# EAGLE design ArduinoDigitalCommsShield (EAGLE 6.5.0)
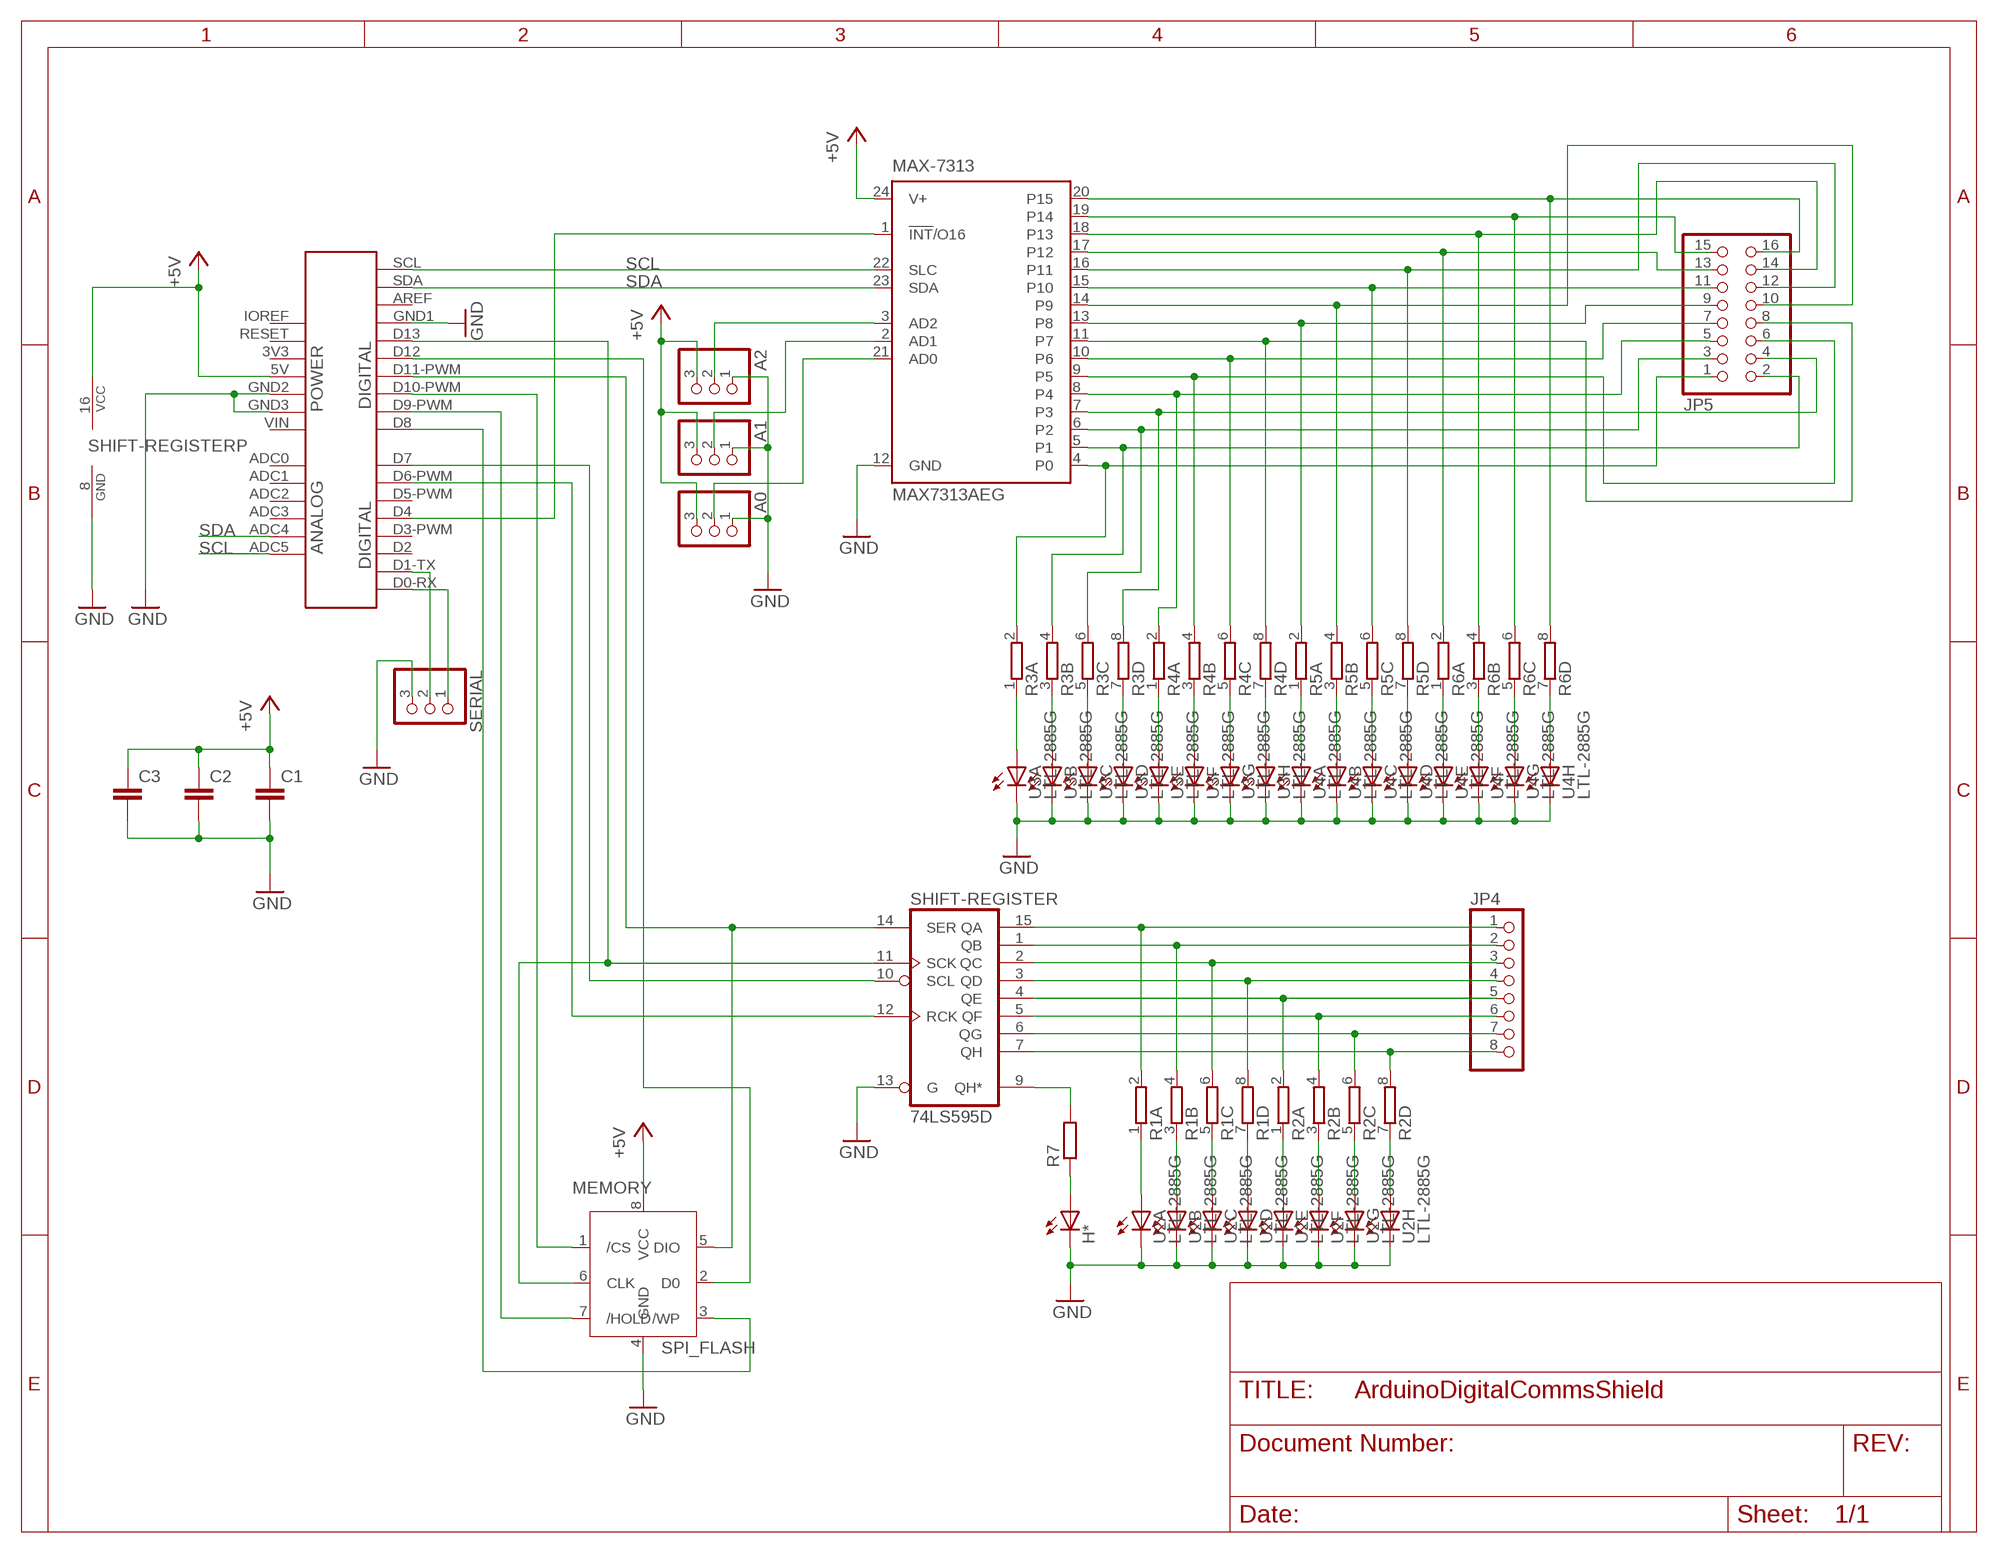
[diagram p0: schematic, sheet 1]

## Parts
A0  PINHD-1X3_2.54  [1X03]
A1  PINHD-1X3_2.54  [1X03]
A2  PINHD-1X3_2.54  [1X03]
ARD1  UNO-R3  [UNO-R3]
C1  C-EUC0603  [C0603]
C2  C-EUC0603  [C0603]
C3  C-EUC0603  [C0603]
H*  LED5MM  [LED5MM]
JP4  PINHD-1X8_2.54  [1X08]
JP5  PINHD-2X8_2.54  [2X08]
MAX-7313  MAX7313AEG  [QSOP24]
MEMORY  SPI_FLASH  [SOIC-8]
R1  4R-NCTS742C083  [CTS742C083-RES]
R2  4R-NCTS742C083  [CTS742C083-RES]
R3  4R-NCTS742C083  [CTS742C083-RES]
R4  4R-NCTS742C083  [CTS742C083-RES]
R5  4R-NCTS742C083  [CTS742C083-RES]
R6  4R-NCTS742C083  [CTS742C083-RES]
R7  R-EU_R0603  [R0603]
SERIAL  PINHD-1X3_2.54  [1X03]
SHIFT-REGISTER  74LS595D  [SO16]
U2  LTL-2885G  [LTL-2*85]
U3  LTL-2885G  [LTL-2*85]
U4  LTL-2885G  [LTL-2*85]

## Nets
+5V: A0.3 A1.3 A2.3 ARD1.5V C1.1 C2.1 C3.1 MAX-7313.24(V+) MEMORY.8(VCC) SHIFT-REGISTER.16(VCC)
GND: A0.1 A1.1 A2.1 ARD1.GND1 ARD1.GND2 ARD1.GND3 C1.2 C2.2 C3.2 H*.K(C) MAX-7313.12(GND) MEMORY.4(GND) SERIAL.3 SHIFT-REGISTER.8(GND) SHIFT-REGISTER.13(G) U2.1(A:C) U2.4(B:C) U2.5(C:C) U2.8(D:C) U2.9(E:C) U2.12(F:C) U2.13(G:C) U2.16(H:C) U3.1(A:C) U3.4(B:C) U3.5(C:C) U3.8(D:C) U3.9(E:C) U3.12(F:C) U3.13(G:C) U3.16(H:C) U4.1(A:C) U4.4(B:C) U4.5(C:C) U4.8(D:C) U4.9(E:C) U4.12(F:C) U4.13(G:C) U4.16(H:C)
N$1: A2.2 MAX-7313.3(AD2)
N$2: A1.2 MAX-7313.2(AD1)
N$3: A0.2 MAX-7313.21(AD0)
N$4: ARD1.D11-PWM(D11) MEMORY.5(DIO) SHIFT-REGISTER.14(SER)
N$5: ARD1.D13 MEMORY.6(CLK) SHIFT-REGISTER.11(SCK)
N$6: ARD1.D7 SHIFT-REGISTER.10(SCL)
N$7: ARD1.D6-PWM(D6) SHIFT-REGISTER.12(RCK)
N$8: ARD1.D4 MAX-7313.1(!INT!/O16)
N$9: JP4.1 R1.2 SHIFT-REGISTER.15(QA)
N$10: JP4.2 R1.4 SHIFT-REGISTER.1(QB)
N$11: JP4.3 R1.6 SHIFT-REGISTER.2(QC)
N$12: JP4.4 R1.8 SHIFT-REGISTER.3(QD)
N$13: JP4.5 R2.2 SHIFT-REGISTER.4(QE)
N$14: JP4.6 R2.4 SHIFT-REGISTER.5(QF)
N$15: JP4.7 R2.6 SHIFT-REGISTER.6(QG)
N$16: JP4.8 R2.8 SHIFT-REGISTER.7(QH)
N$17: JP5.1 MAX-7313.4(P0) R3.2
N$18: JP5.2 MAX-7313.5(P1) R3.4
N$19: JP5.3 MAX-7313.6(P2) R3.6
N$20: JP5.4 MAX-7313.7(P3) R3.8
N$21: JP5.5 MAX-7313.8(P4) R4.2
N$22: JP5.6 MAX-7313.9(P5) R4.4
N$23: JP5.7 MAX-7313.10(P6) R4.6
N$24: JP5.8 MAX-7313.11(P7) R4.8
N$25: JP5.16 MAX-7313.20(P15) R6.8
N$26: JP5.15 MAX-7313.19(P14) R6.6
N$27: JP5.14 MAX-7313.18(P13) R6.4
N$28: JP5.13 MAX-7313.17(P12) R6.2
N$29: JP5.12 MAX-7313.16(P11) R5.8
N$30: JP5.11 MAX-7313.15(P10) R5.6
N$31: JP5.10 MAX-7313.14(P9) R5.4
N$32: JP5.9 MAX-7313.13(P8) R5.2
N$33: ARD1.D10-PWM(D10) MEMORY.1(/CS)
N$34: ARD1.D12 MEMORY.2(D0)
N$35: ARD1.D9-PWM(D9) MEMORY.7(/HOLD)
N$36: ARD1.D8 MEMORY.3(/WP)
N$37: ARD1.D1-TX(D1) SERIAL.2
N$38: ARD1.D0-RX(D0) SERIAL.1
N$39: H*.A R7.1
N$40: R7.2 SHIFT-REGISTER.9(QH*)
N$54: R1.1 U2.2(A:A)
N$55: R1.3 U2.3(B:A)
N$56: R1.5 U2.6(C:A)
N$57: R1.7 U2.7(D:A)
N$58: R2.1 U2.10(E:A)
N$59: R2.3 U2.11(F:A)
N$60: R2.5 U2.14(G:A)
N$61: R2.7 U2.15(H:A)
N$62: R3.1 U3.2(A:A)
N$63: R3.3 U3.3(B:A)
N$64: R3.5 U3.6(C:A)
N$65: R3.7 U3.7(D:A)
N$66: R4.1 U3.10(E:A)
N$67: R4.3 U3.11(F:A)
N$68: R4.5 U3.14(G:A)
N$69: R4.7 U3.15(H:A)
N$70: R5.1 U4.2(A:A)
N$71: R5.3 U4.3(B:A)
N$72: R5.5 U4.6(C:A)
N$73: R5.7 U4.7(D:A)
N$74: R6.1 U4.10(E:A)
N$75: R6.3 U4.11(F:A)
N$76: R6.5 U4.14(G:A)
N$77: R6.7 U4.15(H:A)
SCL: ARD1.ADC5 ARD1.SCL MAX-7313.22(SLC)
SDA: ARD1.ADC4 ARD1.SDA MAX-7313.23(SDA)
Unconnected: ARD1.3V3 ARD1.ADC0 ARD1.ADC1 ARD1.ADC2 ARD1.ADC3 ARD1.AREF ARD1.D2 ARD1.D3-PWM(D3) ARD1.D5-PWM(D5) ARD1.IOREF ARD1.RESET ARD1.VIN

## Library data of the parts
A0 A1 A2 SERIAL = pinhead-1:PINHD-1X3: PIN HEADER
ARD1 = arduino-shields:UNO-R3
C1-C3 = resistor:C-EU: CAPACITOR, European symbol
H* = led:LED: LED OSRAM: - CHIPLED LG R971, LG N971, LY N971, LG Q971, LY Q971, LO R971, LY R971 LH N974, LH R974 LS Q976, LO Q976, LY Q976 LO Q996 - Hyper CHIPLED LW Q18S LB Q993, LB Q99A, LB R99A - SideLED LS A670, LO A670, LY A670, LG A670, LP A670 LB A673, LV A673, LT A673, LW A673 LH A674 LY A675 LS A676, LA A676, LO A676, LY A676, LW A676 LS A679, LY A679, LG A679 - Hyper Micro SIDELED® LS Y876, LA Y876, LO Y876, LY Y876 LT Y87S - SmartLED LW L88C, LW L88S LB L89C, LB L89S, LG L890 LS L89K, LO L89K, LY L89K LS L896, LA L896, LO L896, LY L896 - TOPLED LS T670, LO T670, LY T670, LG T670, LP T670 LSG T670, LSP T670, LSY T670, LOP T670, LYG T670 LG T671, LOG T671, LSG T671 LB T673, LV T673, LT T673, LW T673 LH T674 LS T676, LA T676, LO T676, LY T676, LB T676, LH T676, LSB T676, LW T676 LB T67C, LV T67C, LT T67C, LS T67K, LO T67K, LY T67K, LW E67C LS E67B, LA E67B, LO E67B, LY E67B, LB E67C, LV E67C, LT E67C LW T67C LS T679, LY T679, LG T679 LS T770, LO T770, LY T770, LG T770, LP T770 LB T773, LV T773, LT T773, LW T773 LH T774 LS E675, LA E675, LY E675, LS T675 LS T776, LA T776, LO T776, LY T776, LB T776 LHGB T686 LT T68C, LB T68C - Hyper Mini TOPLED® LB M676 - Mini TOPLED Santana® LG M470 LS M47K, LO M47K, LY M47K Source: http://www.osram.convergy.de LUXEON: - LUMILED® LXK2-PW12-R00, LXK2-PW12-S00, LXK2-PW14-U00, LXK2-PW14-V00 LXK2-PM12-R00, LXK2-PM12-S00, LXK2-PM14-U00 LXK2-PE12-Q00, LXK2-PE12-R00, LXK2-PE12-S00, LXK2-PE14-T00, LXK2-PE14-U00 LXK2-PB12-K00, LXK2-PB12-L00, LXK2-PB12-M00, LXK2-PB14-N00, LXK2-PB14-P00, LXK2-PB14-Q00 LXK2-PR12-L00, LXK2-PR12-M00, LXK2-PR14-Q00, LXK2-PR14-R00 LXK2-PD12-Q00, LXK2-PD12-R00, LXK2-PD12-S00 LXK2-PH12-R00, LXK2-PH12-S00 LXK2-PL12-P00, LXK2-PL12-Q00, LXK2-PL12-R00 Source: www.luxeon.com KINGBRIGHT: KA-3528ASYC Source: www.kingbright.com
JP4 = pinhead-1:PINHD-1X8: PIN HEADER
JP5 = pinhead-1:PINHD-2X8: PIN HEADER
MAX-7313 = maxim:MAX7313AEG: 16-Port I/O Expander with LED Intensity Control, Interrupt, and Hot-Insertion Protection Source: http://datasheets.maxim-ic.com/en/ds/MAX7313.pdf; MPN: MAX7313AEG+; OC_FARNELL: unknown; OC_NEWARK: 53K7268
MEMORY = ESP8266:SPI_FLASH: SPI Flash
R1-R6 = res-cap-arrays:4R-N: Array Chip Resistor Source: RS Component / Phycomp
R7 = resistor:R-EU_: RESISTOR, European symbol
SHIFT-REGISTER = 74xx-us:74*595: 8-bit SHIFT REGISTER, output latch
U2-U4 = logos-diodes:LTL-2*85; PARTNO: LTL-2885G

## Board
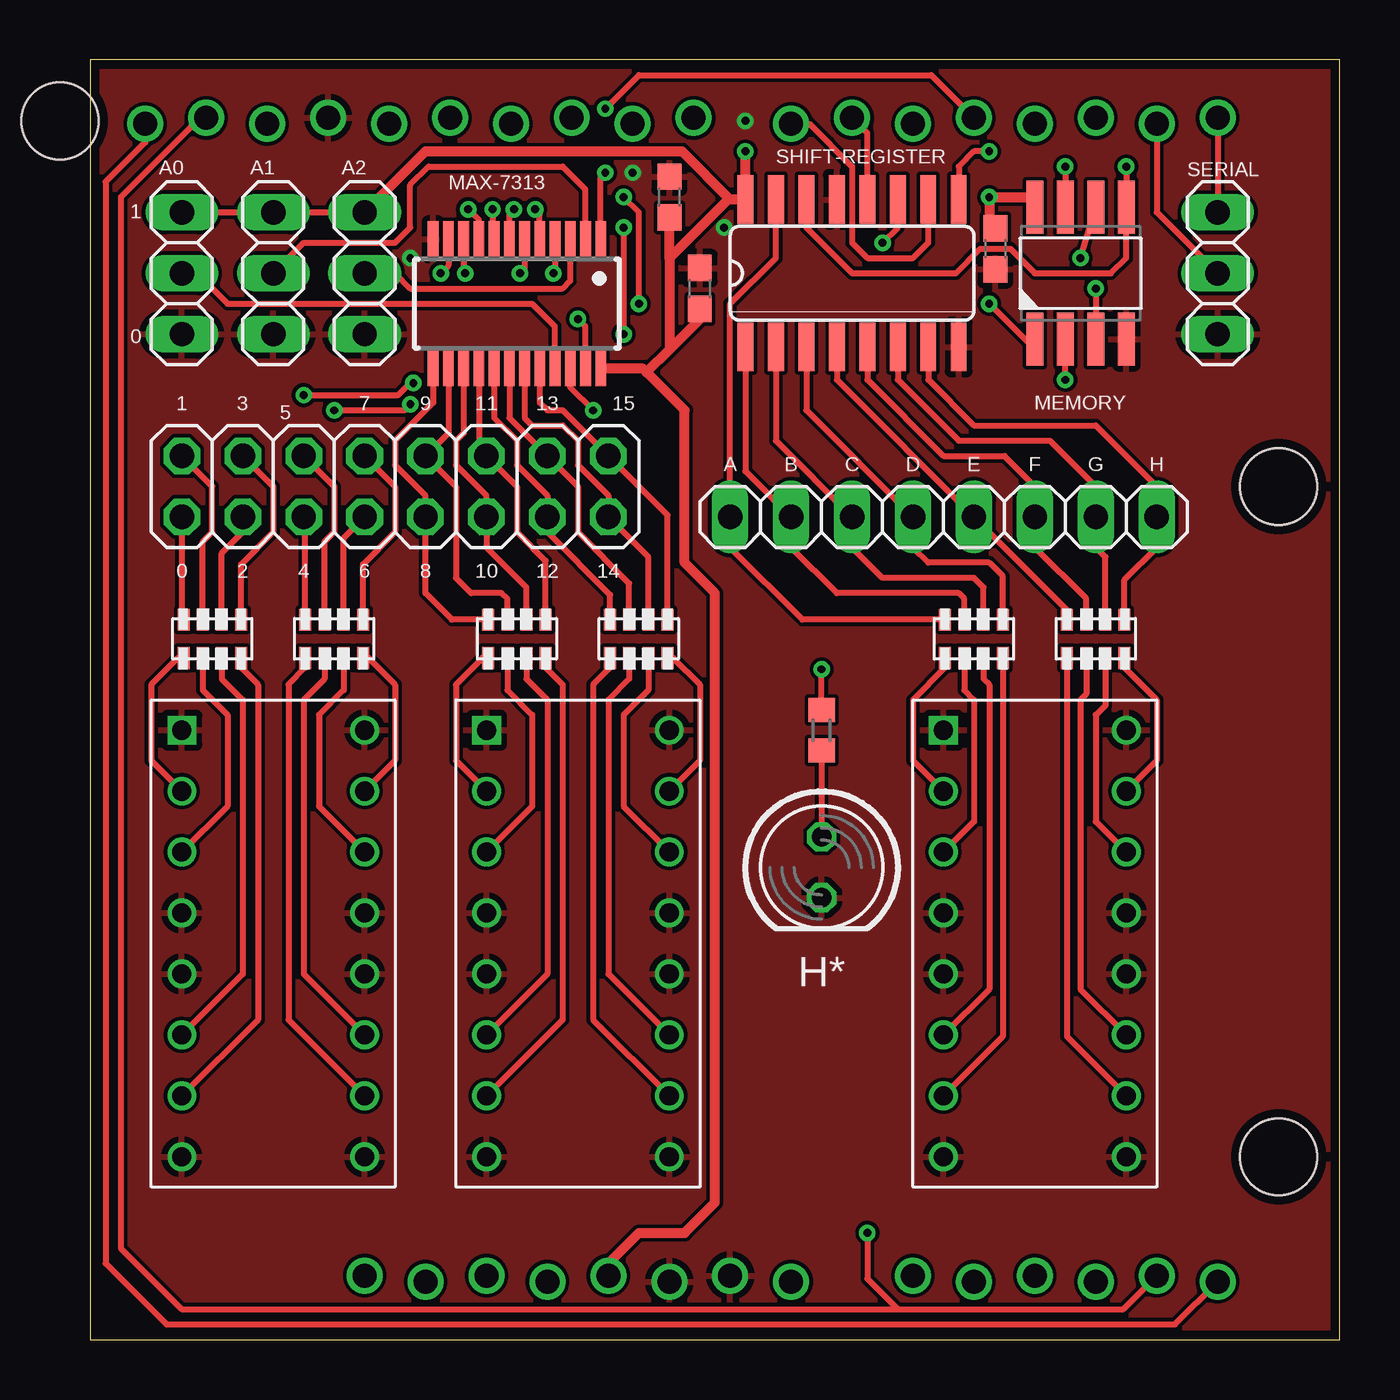
[diagram p1: board, top side]
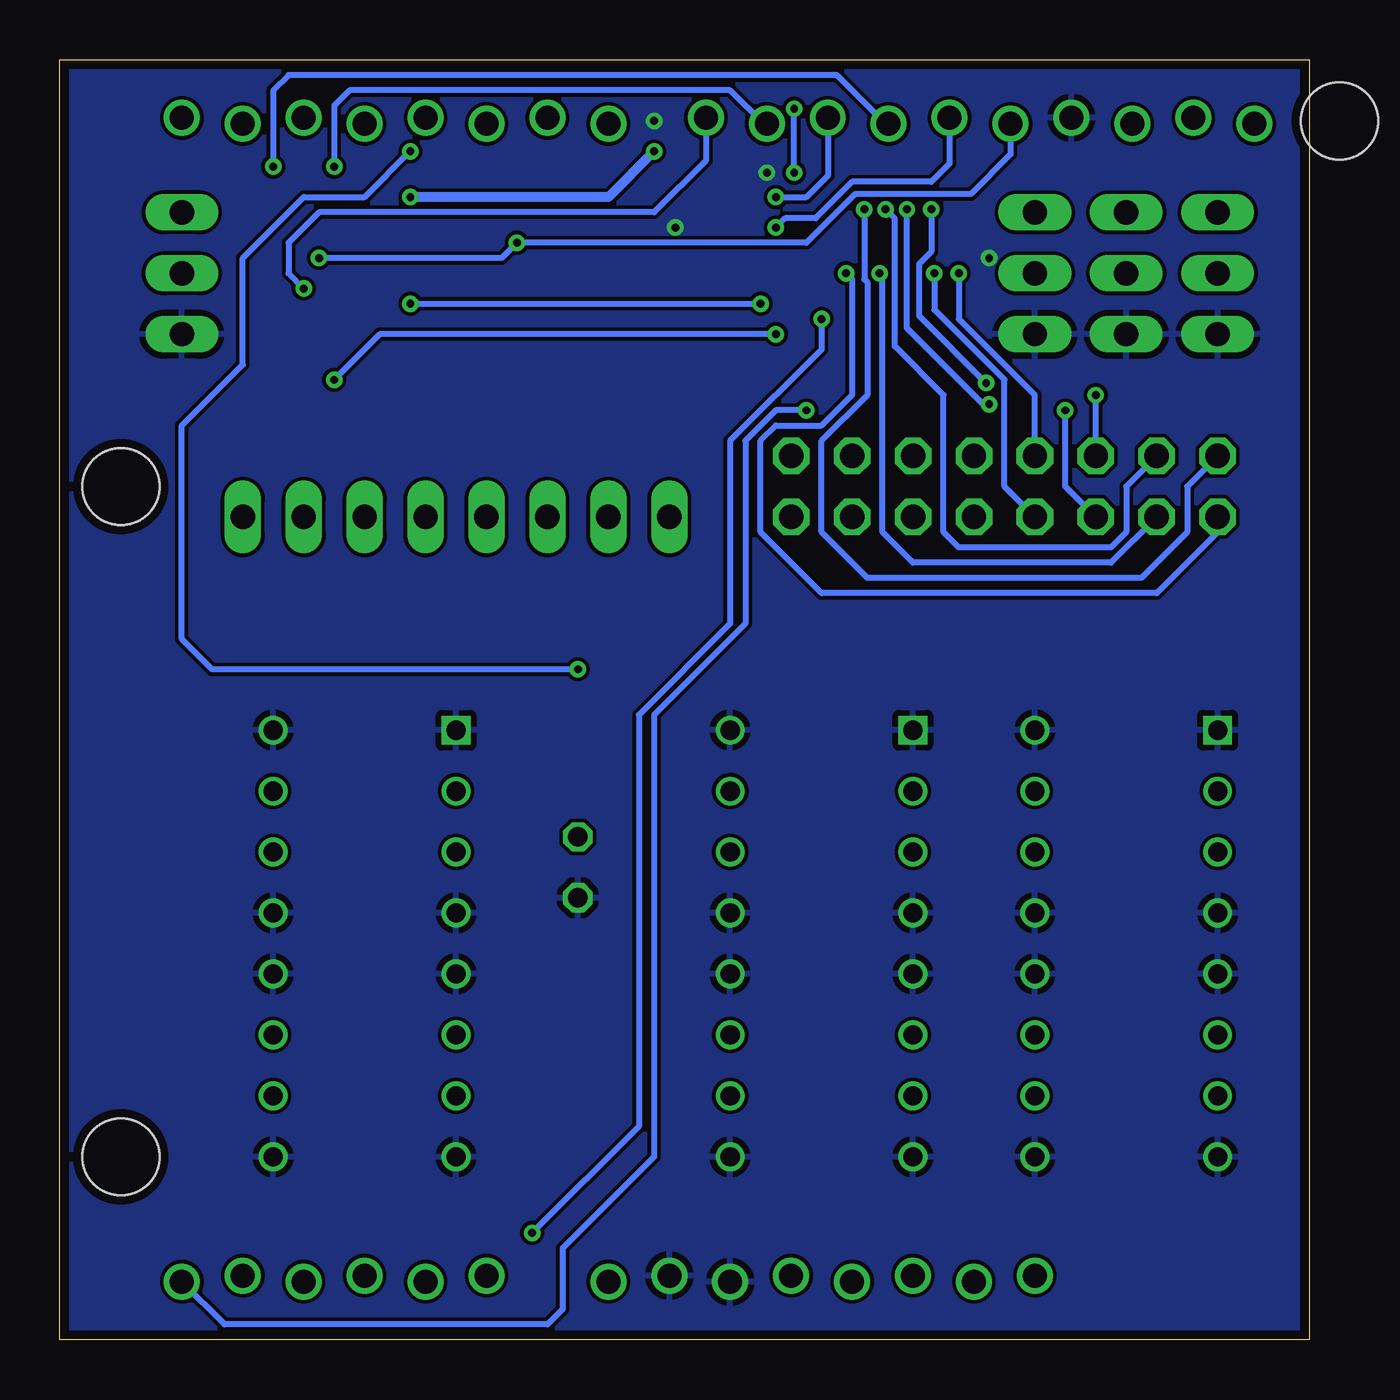
[diagram p2: board, bottom side, seen from below]

Size 52.07 x 53.34 mm. Coordinates in mm from the lower left corner, seen from the top.
Outline: 0,0 52.07,0 52.07,53.34 0,53.34 0,0
Copper layers (1*16): Top 0.0356mm / dielectric 1.5011mm / Bottom 0.0356mm
Design rules "LaenPCBOrder": minimum track width 6mil, minimum drill 13mil, track to track 6mil, track to pad 6mil, pad to pad 6mil, via to via 6mil, smd to smd 6mil, copper to edge 15mil, drill to drill 6mil, minimum pad ring 7mil, minimum via ring 7mil, stop-mask expansion 4mil, vias tented up to drill 0mil, thermal gap 10mil

### Footprints (pad centres in the part's own frame; a part is rotated, then mirrored left to right if it is on the bottom)
1X03 = drill 1.016 long: 1 -2.54,0; 2 0,0; 3 2.54,0
UNO-R3 = drill 1: 3V3 35.56,2.413; 5V 38.1,2.667; ADC0 50.8,2.667; ADC1 53.34,2.413; ADC2 55.88,2.667; ADC3 58.42,2.413; ADC4 60.96,2.667; ADC5 63.5,2.413; AREF 23.876,50.673; D0-RX 63.5,50.927; D1-TX 60.96,50.673; D2 58.42,50.927; D3-PWM 55.88,50.673; D4 53.34,50.927; D5-PWM 50.8,50.673; D6-PWM 48.26,50.927; D7 45.72,50.673; D8 41.656,50.927; D9-PWM 39.116,50.673; D10-PWM 36.576,50.927; D11-PWM 34.036,50.673; D12 31.496,50.927; D13 28.956,50.673; GND1 26.416,50.927; GND2 40.64,2.413; GND3 43.18,2.667; IOREF 30.48,2.413; NC 27.94,2.667; RESET 33.02,2.667; SCL 18.796,50.673; SDA 21.336,50.927; VIN 45.72,2.413 | hole 3.2: 15.24,50.8; 66.04,35.56; 66.04,7.62
C0603 = smd 1.1 x 1: 1 -0.85,0; 2 0.85,0
LED5MM = drill 0.813 octagon: A -1.27,0; K 1.27,0
1X08 = drill 1.016 long: 1 -8.89,0; 2 -6.35,0; 3 -3.81,0; 4 -1.27,0; 5 1.27,0; 6 3.81,0; 7 6.35,0; 8 8.89,0
2X08 = drill 1.016 octagon: 1 -8.89,-1.27; 2 -8.89,1.27; 3 -6.35,-1.27; 4 -6.35,1.27; 5 -3.81,-1.27; 6 -3.81,1.27; 7 -1.27,-1.27; 8 -1.27,1.27; 9 1.27,-1.27; 10 1.27,1.27; 11 3.81,-1.27; 12 3.81,1.27; 13 6.35,-1.27; 14 6.35,1.27; 15 8.89,-1.27; 16 8.89,1.27
QSOP24 = smd 0.45 x 1.5: 1 -3.493,-2.69; 2 -2.857,-2.69; 3 -2.223,-2.69; 4 -1.587,-2.69; 5 -0.953,-2.69; 6 -0.318,-2.69; 7 0.318,-2.69; 8 0.953,-2.69; 9 1.587,-2.69; 10 2.223,-2.69; 11 2.857,-2.69; 12 3.493,-2.69; 13 3.493,2.69; 14 2.857,2.69; 15 2.223,2.69; 16 1.587,2.69; 17 0.953,2.69; 18 0.318,2.69; 19 -0.318,2.69; 20 -0.953,2.69; 21 -1.587,2.69; 22 -2.223,2.69; 23 -2.857,2.69; 24 -3.493,2.69
SOIC-8 = smd 0.7 x 2.2: 1 -1.905,-2.75; 2 -0.635,-2.75; 3 0.635,-2.75; 4 1.905,-2.75; 5 1.905,2.75; 6 0.635,2.75; 7 -0.635,2.75; 8 -1.905,2.75
CTS742C083-RES = smd 0.9 x 0.5: 1 -0.8,1.2; 2 0.8,1.2; 3 -0.8,0.4; 4 0.8,0.4; 5 -0.8,-0.4; 6 0.8,-0.4; 7 -0.8,-1.2; 8 0.8,-1.2
R0603 = smd 1 x 1.1: 1 -0.85,0; 2 0.85,0
SO16 = smd 0.66 x 2.032: 1 -4.445,-3.073; 2 -3.175,-3.073; 3 -1.905,-3.073; 4 -0.635,-3.073; 5 0.635,-3.073; 6 1.905,-3.073; 7 3.175,-3.073; 8 4.445,-3.073; 9 4.445,3.073; 10 3.175,3.073; 11 1.905,3.073; 12 0.635,3.073; 13 -0.635,3.073; 14 -1.905,3.073; 15 -3.175,3.073; 16 -4.445,3.073
LTL-2*85 = drill 0.8 square: 1 -3.81,8.89 | drill 0.8: 2 -3.81,6.35; 3 -3.81,3.81; 4 -3.81,1.27; 5 -3.81,-1.27; 6 -3.81,-3.81; 7 -3.81,-6.35; 8 -3.81,-8.89; 9 3.81,-8.89; 10 3.81,-6.35; 11 3.81,-3.81; 12 3.81,-1.27; 13 3.81,1.27; 14 3.81,3.81; 15 3.81,6.35; 16 3.81,8.89

### Placement (x,y rotation side)
A0  3.81,44.45 90 top
A1  7.62,44.45 90 top
A2  11.43,44.45 90 top
ARD1  -16.51,0 0 top
C1  24.13,47.62 90 top
C2  25.4,43.81 90 top
C3  37.72,45.47 270 top
H*  30.48,19.68 270 top
JP4  35.56,34.29 0 top
JP5  12.7,35.56 0 top
MAX-7313  17.78,43.18 180 top
MEMORY  41.27,44.45 0 top
R1  36.83,29.21 90 top
R2  41.91,29.21 90 top
R3  5.08,29.21 90 top
R4  10.16,29.21 90 top
R5  17.78,29.21 90 top
R6  22.86,29.21 90 top
R7  30.48,25.4 90 top
SERIAL  46.99,44.45 270 top
SHIFT-REGISTER  31.75,44.45 0 top
U2  39.37,16.51 0 top
U3  7.62,16.51 0 top
U4  20.32,16.51 0 top

### Tracks (layer width: path | path; a pad name or v marks a point on that pad's centre or on a via)
+5V  (via drill 0.33)
  Top 0.254: A0.3 A1.3 A2.3
  Top 0.406: ARD1.5V 21.59,3.17 22.86,4.45 24.77,4.45 26.04,5.71 26.04,31.11 24.77,32.38 24.77,38.73 23.18,40.32 | 23.18,40.32 23.01,40.49 MAX-7313.24 | 26.67,47.52 SHIFT-REGISTER.16 v27.3,49.53 | 26.67,47.52 26.57,47.52 24.13,45.09 | 24.13,45.09 24.13,41.27 | 24.13,41.27 23.18,40.32 | A2.3 13.97,49.53 24.66,49.53 26.67,47.52 | MEMORY.8 39.37,47.62 v37.47,47.62 37.47,46.57 C3.1 | 24.13,45.09 C1.1 | C2.1 25.4,42.55 24.13,41.27
  Bottom 0.406: v27.3,49.53 29.21,47.62 v37.47,47.62
GND  (via drill 0.33)
  other vias: 13.34,45.09 22.61,48.64 27.3,50.8 26.42,46.35
  pour Top: 0,53.34 52.07,53.34 52.07,0 0,0
  pour Bottom: 0,53.34 52.07,53.34 52.07,0 0,0
N$1
  Top 0.254: A2.2 12.7,44.45 13.34,43.81 19.68,43.81 20,44.13 MAX-7313.3
N$2
  Top 0.254: A1.2 8.89,45.72 12.7,45.72 13.34,46.35 13.34,48.13 14.1,48.9 19.68,48.9 20.64,47.94 MAX-7313.2
N$3
  Top 0.254: A0.2 4.45,44.45 5.71,43.18 18.41,43.18 19.37,42.23 MAX-7313.21
N$4  (via drill 0.33)
  Top 0.254: SHIFT-REGISTER.14 29.84,46.35 31.75,44.45 36.07,44.45 37.08,45.47 38.35,45.47 39.37,44.45 42.55,44.45 43.18,45.09 MEMORY.5 v43.18,48.9
  Bottom 0.254: ARD1.D11-PWM 17.65,50.67 19.68,52.7 42.55,52.7 43.18,52.07 v43.18,48.9
N$5  (via drill 0.33)
  Top 0.254: SHIFT-REGISTER.11 33.66,46.35 v33.02,45.72 | v41.27,45.09 MEMORY.6
  Bottom 0.254: ARD1.D13 12.45,49.4 14.1,47.75 18.92,47.75 20.95,45.72 v33.02,45.72 33.66,45.09 v41.27,45.09
N$6
  Top 0.254: ARD1.D7 29.97,50.67 31.75,48.9 31.75,45.72 32.38,45.09 34.29,45.09 34.92,45.72 SHIFT-REGISTER.10
N$7
  Top 0.254: SHIFT-REGISTER.12 32.38,50.29 ARD1.D6-PWM
N$8  (via drill 0.33)
  Top 0.254: MAX-7313.1 21.27,48.45 v21.46,48.64 | v21.46,51.31 22.86,52.7 35.05,52.7 ARD1.D4
  Bottom 0.254: v21.46,48.64 v21.46,51.31
N$9
  Top 0.254: R1.2 29.68,30.01 26.67,33.02 JP4.1 26.67,43.18 28.57,45.09 SHIFT-REGISTER.15
N$10
  Top 0.254: R1.4 36.43,30.88 36.2,31.11 31.11,31.11 29.21,33.02 JP4.2 27.3,36.2 SHIFT-REGISTER.1
N$11
  Top 0.254: R1.6 37.23,31.35 36.83,31.75 33.02,31.75 31.75,33.02 JP4.3 28.57,37.47 SHIFT-REGISTER.2
N$12
  Top 0.254: R1.8 38.03,31.82 37.47,32.38 34.92,32.38 34.29,33.02 JP4.4 29.84,38.73 SHIFT-REGISTER.3
N$13
  Top 0.254: R2.2 40.71,30.41 JP4.5 31.11,40.01 SHIFT-REGISTER.4
N$14
  Top 0.254: R2.4 41.51,30.88 39.37,33.02 JP4.6 39.37,35.56 38.1,36.83 35.56,36.83 32.38,40.01 SHIFT-REGISTER.5
N$15
  Top 0.254: R2.6 42.31,32.62 41.91,33.02 JP4.7 41.91,35.56 40.01,37.47 36.2,37.47 33.66,40.01 SHIFT-REGISTER.6
N$16
  Top 0.254: R2.8 43.11,31.68 44.45,33.02 JP4.8 44.45,35.56 41.91,38.1 36.83,38.1 34.92,40.01 SHIFT-REGISTER.7
N$17  (via drill 0.33)
  Top 0.254: JP5.1 3.81,30.08 R3.2 | MAX-7313.4 19.37,44.51 v19.3,44.45
  Bottom 0.254: JP5.1 3.81,33.66 6.35,31.11 20.32,31.11 22.86,33.66 22.86,37.47 22.23,38.1 20.32,38.1 19.05,39.37 19.05,44.2 v19.3,44.45
N$18  (via drill 0.33)
  Top 0.254: R3.4 4.68,33.26 5.08,33.66 5.08,35.56 JP5.2 | MAX-7313.5 18.73,46.93 v18.54,47.12
  Bottom 0.254: JP5.2 5.08,35.56 5.08,33.66 6.99,31.75 18.41,31.75 20.32,33.66 20.32,37.47 18.41,39.37 18.41,44.07 18.54,44.2 v18.54,47.12
N$19  (via drill 0.33)
  Top 0.254: R3.6 5.48,32.78 6.35,33.66 JP5.3 | MAX-7313.6 18.1,44.64 v17.91,44.45
  Bottom 0.254: JP5.3 8.26,32.38 16.51,32.38 17.78,33.66 17.78,44.32 v17.91,44.45
N$20  (via drill 0.33)
  Top 0.254: R3.8 6.28,32.31 7.62,33.66 7.62,35.56 JP5.4 | 17.53,46.99 v17.65,47.12 17.46,46.93 MAX-7313.7
  Bottom 0.254: JP5.4 7.62,35.56 7.62,33.66 8.26,33.02 14.61,33.02 15.24,33.66 15.24,39.37 17.27,41.4 17.27,46.74 v17.65,47.12
N$21  (via drill 0.33)
  Top 0.254: R4.2 8.96,34.22 JP5.5 | v10.16,38.73 13.08,38.73 v13.34,38.99 | v16.76,47.12 16.76,46.48 16.83,46.42 MAX-7313.8
  Bottom 0.254: JP5.5 10.16,35.56 v10.16,38.73 | v13.34,38.99 13.59,38.99 16.76,42.16 v16.76,47.12
N$22  (via drill 0.33)
  Top 0.254: JP5.6 10.16,35.56 10.16,33.66 9.76,33.26 R4.4 | v8.89,39.37 12.83,39.37 13.34,39.88 v13.46,39.88 | MAX-7313.9 16.19,46.67 v15.75,47.12
  Bottom 0.254: JP5.6 v8.89,39.37 | v13.46,39.88 16.26,42.67 16.26,44.83 15.75,45.34 v15.75,47.12
N$23  (via drill 0.33)
  Top 0.254: R4.6 10.56,33.42 JP5.7 | MAX-7313.10 15.56,44.51 v15.62,44.45
  Bottom 0.254: JP5.7 12.7,35.56 12.7,40.01 15.62,42.93 v15.62,44.45
N$24  (via drill 0.33)
  Top 0.254: JP5.8 12.7,35.56 12.7,33.66 11.36,32.31 R4.8 | MAX-7313.11 14.92,44.77 v14.61,44.45
  Bottom 0.254: JP5.8 11.43,39.37 14.61,42.55 v14.61,44.45
N$25
  Top 0.254: R6.8 24.06,34.36 JP5.16 19.68,38.73 19.05,38.73 18.73,39.05 MAX-7313.20
N$26
  Top 0.254: R6.6 23.26,32.62 JP5.15 21.59,35.18 20.32,36.45 20.32,37.47 19.68,38.1 18.41,38.1 18.1,38.42 MAX-7313.19
N$27
  Top 0.254: R6.4 22.46,31.52 20.32,33.66 20.32,35.56 JP5.14 17.46,38.42 MAX-7313.18
N$28
  Top 0.254: R6.2 21.66,31.05 19.05,33.66 JP5.13 19.05,35.18 17.78,36.45 17.78,37.47 16.83,38.42 MAX-7313.17
N$29
  Top 0.254: R5.8 18.98,32.45 17.78,33.66 17.78,35.56 JP5.12 16.19,37.15 MAX-7313.16
N$30
  Top 0.254: R5.6 18.18,31.35 16.51,33.02 JP5.11 16.51,35.18 15.24,36.45 15.24,37.47 15.56,37.78 MAX-7313.15
N$31
  Top 0.254: R5.4 17.38,30.88 17.14,31.11 15.88,31.11 15.24,31.75 15.24,35.56 JP5.10 14.92,37.78 MAX-7313.14
N$32
  Top 0.254: R5.2 15.07,30.01 13.97,31.11 JP5.9 13.97,35.18 12.7,36.45 12.7,37.47 14.29,39.05 MAX-7313.13
N$33  (via drill 0.33)
  Top 0.254: MEMORY.1 39.24,41.4 v37.47,43.18 | v22.86,43.18 22.86,46.99 v22.23,47.62
  Bottom 0.254: ARD1.D10-PWM 20.07,48.51 20.95,47.62 v22.23,47.62 | v37.47,43.18 v22.86,43.18
N$34  (via drill 0.33)
  Top 0.254: v22.23,46.35 v22.23,41.91 | v40.64,40.01 MEMORY.2
  Bottom 0.254: ARD1.D12 14.99,49.02 15.75,48.26 19.05,48.26 20.57,46.74 21.84,46.74 v22.23,46.35 | v22.23,41.91 38.73,41.91 v40.64,40.01
N$35  (via drill 0.33)
  Top 0.254: v40.64,48.9 MEMORY.7
  Bottom 0.254: ARD1.D9-PWM 22.73,50.67 24.13,52.07 40.01,52.07 40.64,51.44 v40.64,48.9
N$36  (via drill 0.33)
  Top 0.254: v41.91,43.81 MEMORY.3
  Bottom 0.254: ARD1.D8 25.15,49.15 27.3,46.99 41.27,46.99 42.55,45.72 42.55,44.45 v41.91,43.81
N$37
  Top 0.254: ARD1.D1-TX 44.45,46.99 SERIAL.2
N$38
  Top 0.254: ARD1.D0-RX SERIAL.1
N$39
  Top 0.254: R7.1 H*.A
N$40  (via drill 0.33)
  Top 0.254: R7.2 v30.48,27.94 | v37.47,49.53 36.83,49.53 36.2,48.9 SHIFT-REGISTER.9
  Bottom 0.254: v30.48,27.94 45.72,27.94 46.99,29.21 46.99,38.1 44.45,40.64 44.45,45.09 41.91,47.62 39.37,47.62 v37.47,49.53
N$54
  Top 0.254: R1.1 35.63,28.01 34.29,26.67 34.29,24.13 U2.2
N$55
  Top 0.254: R1.3 36.43,27.07 36.83,26.67 36.83,21.59 U2.3
N$56
  Top 0.254: R1.5 37.23,27.54 37.47,27.3 37.47,14.61 U2.6
N$57
  Top 0.254: R1.7 38.03,12.63 U2.7
N$58
  Top 0.254: R2.1 40.71,12.63 U2.10
N$59
  Top 0.254: U2.11 41.27,14.61 41.27,26.67 41.51,26.91 R2.3
N$60
  Top 0.254: R2.5 42.31,26.43 41.91,26.04 41.91,21.59 U2.14
N$61
  Top 0.254: R2.7 43.11,28.01 44.45,26.67 44.45,24.13 U2.15
N$62
  Top 0.254: R3.1 3.65,28.41 2.54,27.3 2.54,24.13 U3.2
N$63
  Top 0.254: R3.3 4.68,27.07 5.71,26.04 5.71,22.23 U3.3
N$64
  Top 0.254: R3.5 5.48,27.54 6.35,26.67 6.35,15.24 U3.6
N$65
  Top 0.254: R3.7 6.28,28.01 6.99,27.3 6.99,13.34 U3.7
N$66
  Top 0.254: R4.1 8.96,28.01 8.26,27.3 8.26,13.34 U3.10
N$67
  Top 0.254: R4.3 9.76,27.54 8.89,26.67 8.89,15.24 U3.11
N$68
  Top 0.254: R4.5 10.56,27.07 9.53,26.04 9.53,22.23 U3.14
N$69
  Top 0.254: R4.7 11.6,28.41 12.7,27.3 12.7,24.13 U3.15
N$70
  Top 0.254: R5.1 16.34,28.41 15.24,27.3 15.24,24.13 U4.2
N$71
  Top 0.254: R5.3 17.38,27.07 18.41,26.04 18.41,22.23 U4.3
N$72
  Top 0.254: R5.5 18.18,27.54 19.05,26.67 19.05,15.24 U4.6
N$73
  Top 0.254: R5.7 18.98,28.01 19.68,27.3 19.68,13.34 U4.7
N$74
  Top 0.254: R6.1 21.66,28.01 20.95,27.3 20.95,13.34 U4.10
N$75
  Top 0.254: R6.3 22.46,27.54 21.59,26.67 21.59,15.24 U4.11
N$76
  Top 0.254: R6.5 23.26,27.07 22.23,26.04 22.23,22.23 U4.14
N$77
  Top 0.254: R6.7 24.3,28.41 25.4,27.3 25.4,24.13 U4.15
SCL  (via drill 0.33)
  Top 0.254: ARD1.SCL 2.29,49.91 0.64,48.26 0.64,3.17 3.17,0.64 45.21,0.64 ARD1.ADC5 | MAX-7313.22 20,39.69 v20.95,38.73
  Bottom 0.254: v20.95,38.73 22.23,38.73 23.5,37.47 23.5,29.84 27.3,26.04 27.3,7.62 31.11,3.81 31.11,1.27 31.75,0.64 45.21,0.64 ARD1.ADC5
SDA  (via drill 0.33)
  Top 0.254: ARD1.SDA 4.57,50.93 1.27,47.62 1.27,3.81 3.81,1.27 33.66,1.27 | 33.66,1.27 43.05,1.27 ARD1.ADC4 | MAX-7313.23 20.64,42.23 v20.32,42.55 | v32.38,4.45 32.38,2.54 33.66,1.27
  Bottom 0.254: v20.32,42.55 20.32,41.27 24.13,37.47 24.13,29.84 27.94,26.04 27.94,8.89 v32.38,4.45

### Text on the board
tPlace: 1 | 0 | 1 | 3 | 7 | 9 | 11 | 13 | 15 | 5 | A | B | C | D | E | F | G | H | 0 | 2 | 4 | 6 | 8 | 10 | 12 | 14